# EAGLE design BalloonFPC_2x8 (EAGLE 9.6.2)
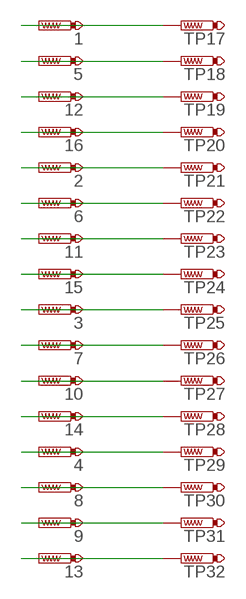
[diagram p0: schematic, sheet 1]

## Parts
1  PTR11X2MM  [ELECPAD]
2  PTR11X2MM  [ELECPAD]
3  PTR11X2MM  [ELECPAD]
4  PTR11X2MM  [ELECPAD]
5  PTR11X2MM  [ELECPAD]
6  PTR11X2MM  [ELECPAD]
7  PTR11X2MM  [ELECPAD]
8  PTR11X2MM  [ELECPAD]
9  PTR11X2MM  [ELECPAD]
10  PTR11X2MM  [ELECPAD]
11  PTR11X2MM  [ELECPAD]
12  PTR11X2MM  [ELECPAD]
13  PTR11X2MM  [ELECPAD]
14  PTR11X2MM  [ELECPAD]
15  PTR11X2MM  [ELECPAD]
16  PTR11X2MM  [ELECPAD]
TP17  PTR1ZIF  [ZIFPAD]
TP18  PTR1ZIF  [ZIFPAD]
TP19  PTR1ZIF  [ZIFPAD]
TP20  PTR1ZIF  [ZIFPAD]
TP21  PTR1ZIF  [ZIFPAD]
TP22  PTR1ZIF  [ZIFPAD]
TP23  PTR1ZIF  [ZIFPAD]
TP24  PTR1ZIF  [ZIFPAD]
TP25  PTR1ZIF  [ZIFPAD]
TP26  PTR1ZIF  [ZIFPAD]
TP27  PTR1ZIF  [ZIFPAD]
TP28  PTR1ZIF  [ZIFPAD]
TP29  PTR1ZIF  [ZIFPAD]
TP30  PTR1ZIF  [ZIFPAD]
TP31  PTR1ZIF  [ZIFPAD]
TP32  PTR1ZIF  [ZIFPAD]

## Nets
1: 1.TP TP17.TP
2: 2.TP TP21.TP
3: 3.TP TP25.TP
4: 4.TP TP29.TP
5: 5.TP TP18.TP
6: 6.TP TP22.TP
7: 7.TP TP26.TP
8: 8.TP TP30.TP
9: 9.TP TP31.TP
10: 10.TP TP27.TP
11: 11.TP TP23.TP
12: 12.TP TP19.TP
13: 13.TP TP32.TP
14: 14.TP TP28.TP
15: 15.TP TP24.TP
16: 16.TP TP20.TP

## Library data of the parts
1-16 TP17-TP32 = RigidPCBSensor_1:PTR1: TEST PIN

## Board
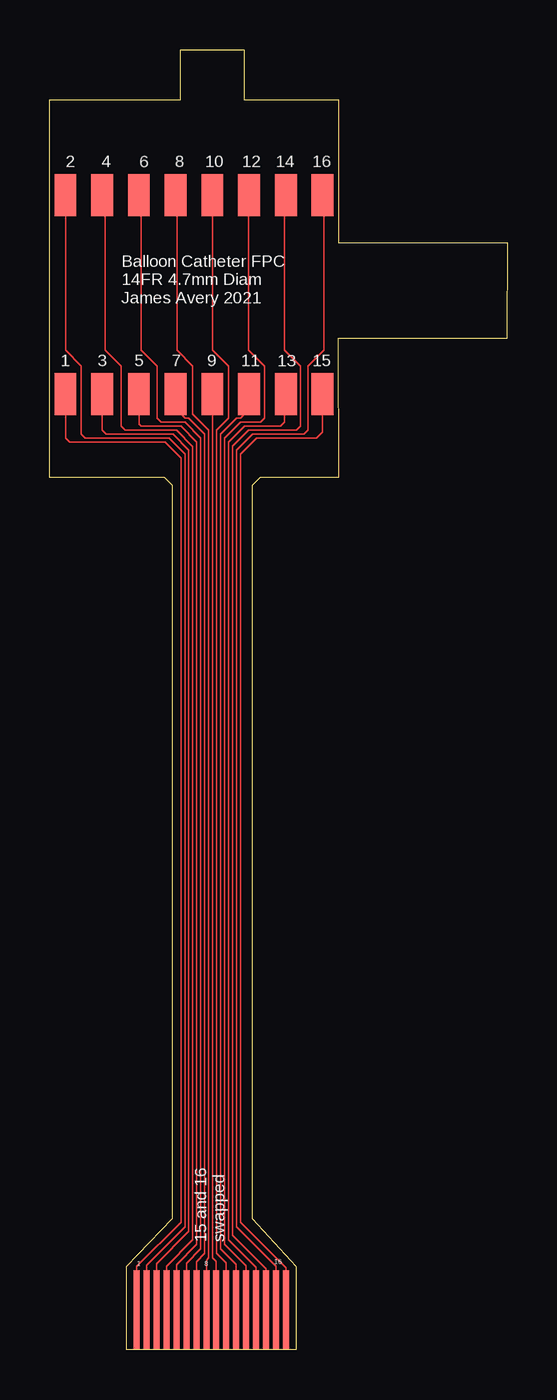
[diagram p1: board, top side]

Size 22.99 x 65.3 mm. Coordinates in mm from the lower left corner, seen from the top.
Outline: 0,43.8 0,62.8 6.57,62.8 6.57,65.3 9.77,65.3 9.77,62.8 14.5,62.8 14.5,55.6 22.99,55.6 22.98,50.8 14.49,50.8 14.5,43.8 10.57,43.8 10.17,43.4 10.17,6.6 12.37,4.2 12.37,0 3.87,0 3.87,4.2 6.17,6.6 6.17,43.4 5.77,43.8 0,43.8
Copper layers (1*16): Top 0.035mm / dielectric 1.5mm / Bottom 0.035mm
Design rules "SparkFun-2-layer-PCBWay-LIMIT FPC": minimum track width 0.08mm, minimum drill 0.3mm, track to track 0.08mm, track to pad 0.08mm, pad to pad 0.08mm, via to via 0.08mm, smd to smd 0.08mm, copper to edge 6mil, drill to drill 6mil, minimum pad ring 6mil, minimum via ring 6mil, stop-mask expansion 4mil, vias tented up to drill 25mil, thermal gap 10mil

### Footprints (pad centres in the part's own frame; a part is rotated, then mirrored left to right if it is on the bottom)
ELECPAD = smd 1.1 x 2.1: TP 0,0
ZIFPAD = smd 0.3 x 4: TP 0,0

### Placement (x,y rotation side)
1  0.79,48 0 top
2  0.79,58 0 top
3  2.64,48 0 top
4  2.64,58 0 top
5  4.48,48 0 top
6  4.48,58 0 top
7  6.33,48 0 top
8  6.33,58 0 top
9  8.17,48 0 top
10  8.17,58 0 top
11  10.02,48 0 top
12  10.02,58 0 top
13  11.86,48 0 top
14  11.86,58 0 top
15  13.71,48 0 top
16  13.71,58 0 top
TP17  4.37,2 0 top
TP18  6.37,2 0 top
TP19  9.87,2 0 top
TP20  11.37,2 0 top
TP21  4.87,2 0 top
TP22  6.87,2 0 top
TP23  9.37,2 0 top
TP24  11.87,2 0 top
TP25  5.37,2 0 top
TP26  7.37,2 0 top
TP27  8.87,2 0 top
TP28  10.87,2 0 top
TP29  5.87,2 0 top
TP30  7.87,2 0 top
TP31  8.37,2 0 top
TP32  10.37,2 0 top

### Tracks (layer width: path | path; a pad name or v marks a point on that pad's centre or on a via)
1
  Top 0.08: TP17.TP 4.37,4.18 6.59,6.4 6.59,44.8 5.79,45.6 0.99,45.6 0.79,45.8 1.TP
2
  Top 0.08: 2.TP 0.79,50.2 1.59,49.4 1.59,46 1.79,45.8 5.99,45.8 6.79,45 6.79,6.17 4.87,4.25 TP21.TP
3
  Top 0.08: TP25.TP 5.37,4.33 6.99,5.95 6.99,45.2 6.19,46 2.84,46 2.64,46.2 3.TP
4
  Top 0.08: 4.TP 2.79,57.85 2.79,50.2 3.59,49.4 3.59,46.4 3.79,46.2 6.36,46.2 7.19,45.37 7.19,5.52 5.87,4.2 TP29.TP
5
  Top 0.08: TP18.TP 6.37,4.27 7.39,5.3 7.39,45.6 6.59,46.4 4.59,46.4 4.48,46.51 5.TP
6
  Top 0.08: 6.TP 4.59,57.89 4.59,50.2 5.39,49.4 5.39,46.8 5.59,46.6 6.79,46.6 7.59,45.8 7.59,5.07 6.87,4.35 TP22.TP
7
  Top 0.08: 7.TP 6.33,47.26 6.79,46.8 6.99,46.8 7.79,46 7.79,4.84 7.37,4.42 TP26.TP
8
  Top 0.08: 8.TP 6.39,57.94 6.39,50.2 7.19,49.4 7.19,47 7.99,46.2 7.99,4.62 7.87,4.5 TP30.TP
9
  Top 0.08: 9.TP 8.19,47.98 8.19,4.62 8.37,4.44 TP31.TP
10
  Top 0.08: 10.TP 8.19,57.98 8.19,50.2 8.99,49.4 8.99,46.8 8.39,46.2 8.39,4.84 8.87,4.36 TP27.TP
11
  Top 0.08: TP23.TP 9.37,4.29 8.59,5.07 8.59,46 9.39,46.8 9.59,46.8 10.02,47.23 11.TP
12
  Top 0.08: 12.TP 9.99,57.97 9.99,50.2 10.79,49.4 10.79,46.8 10.59,46.6 9.59,46.6 8.79,45.8 8.79,5.3 9.87,4.22 TP19.TP
13
  Top 0.08: TP32.TP 10.37,4.14 8.99,5.52 8.99,45.6 9.79,46.4 11.59,46.4 11.79,46.6 11.79,47.93 13.TP
14
  Top 0.08: 14.TP 11.79,57.93 11.79,50.2 12.59,49.4 12.59,46.4 12.39,46.2 9.99,46.2 9.19,45.4 9.19,5.75 10.87,4.07 TP28.TP
15
  Top 0.08: TP24.TP 11.87,4.12 9.59,6.4 9.59,45 10.39,45.8 13.42,45.8 13.71,46.09 15.TP
16
  Top 0.08: 16.TP 13.79,57.92 13.79,50.2 12.99,49.4 12.99,46.2 12.79,46 10.19,46 9.39,45.2 9.39,6.17 11.37,4.19 TP20.TP

### Text on the board
tNames: Balloon Catheter FPC / 14FR 4.7mm Diam / James Avery 2021 | 15 and 16 / swapped | 1 | 8 | 16